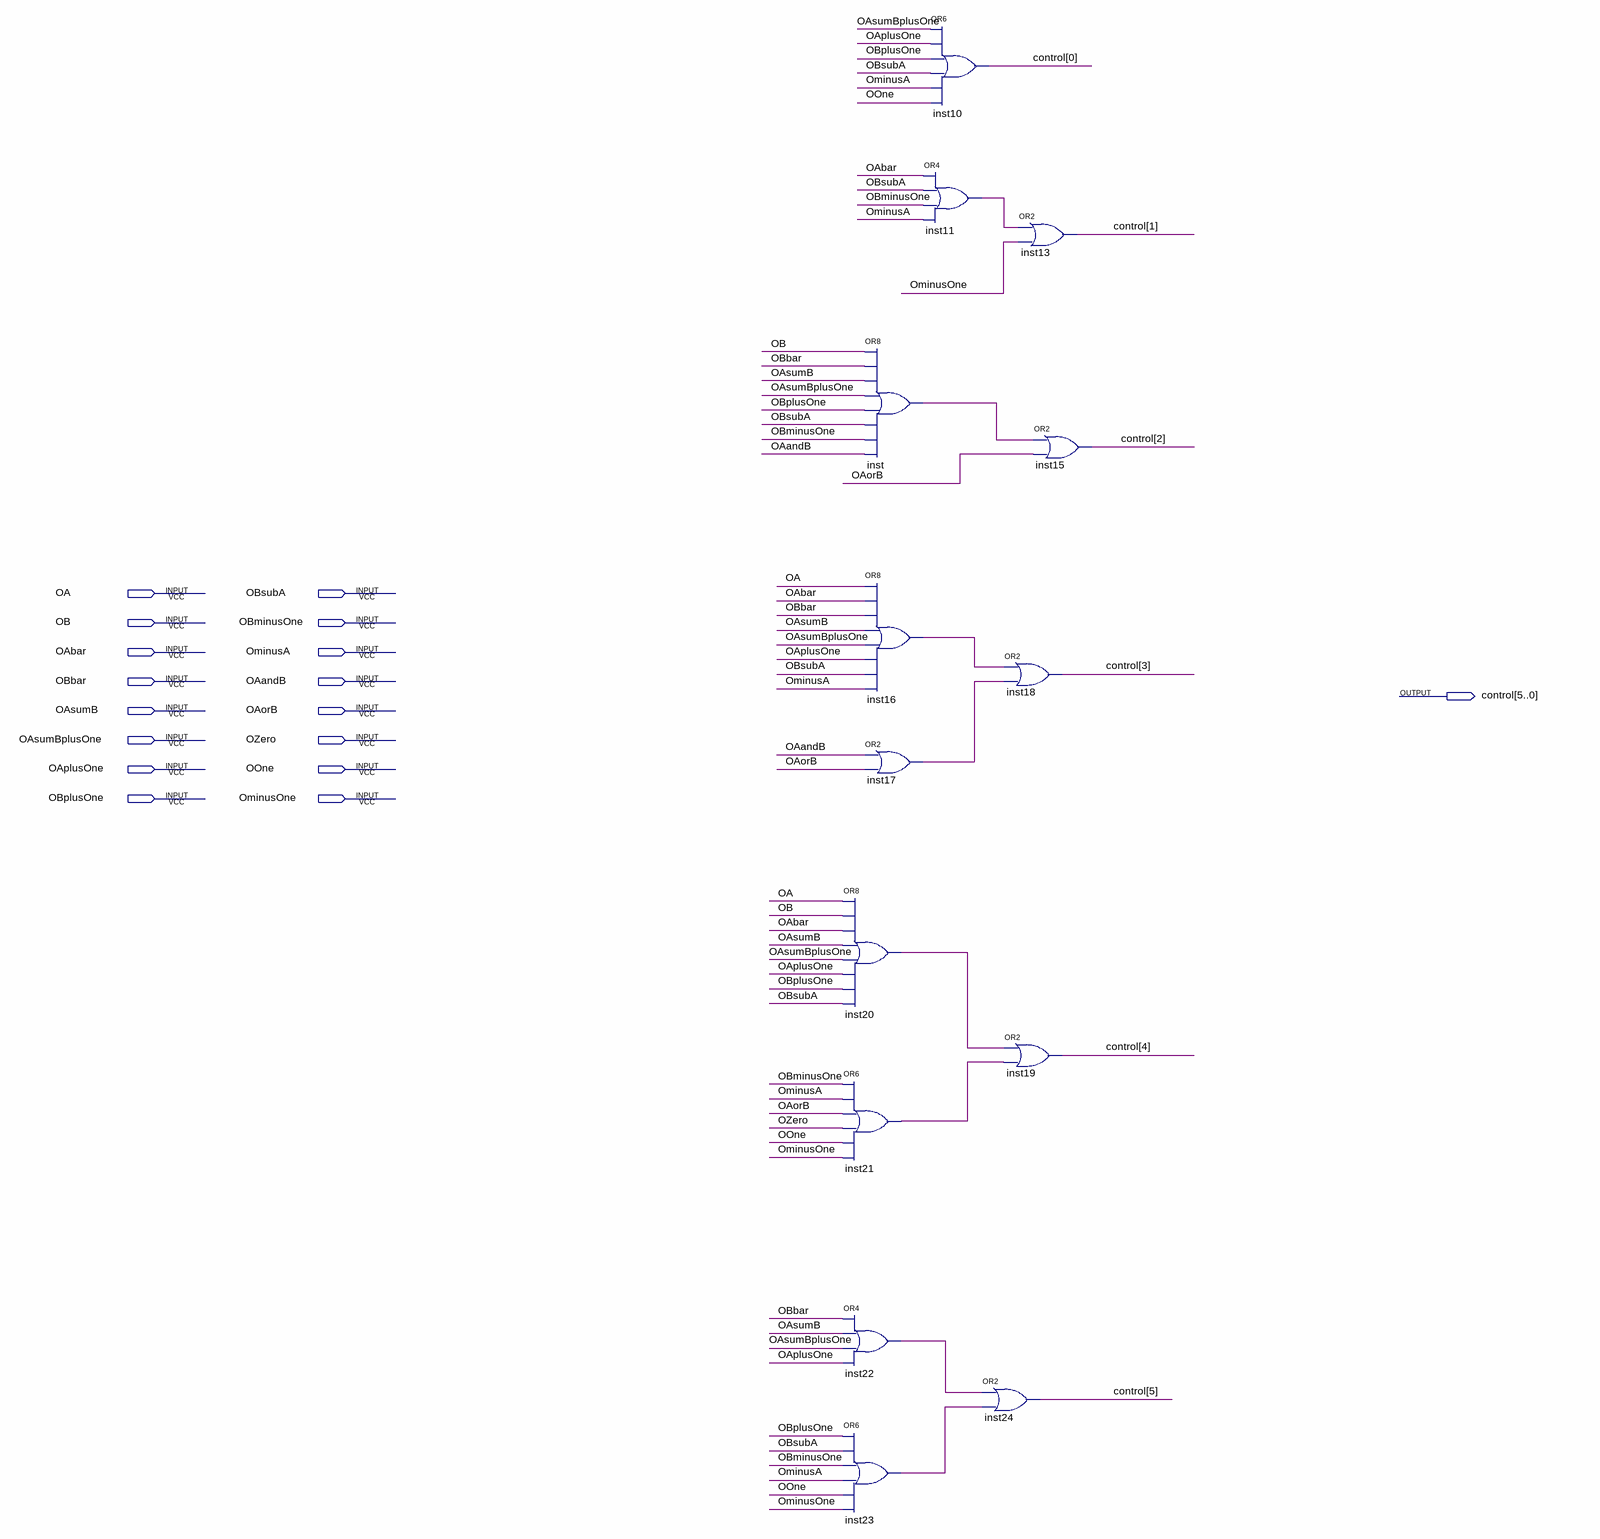
[diagram p0: schematic sheet]
// Quartus schematic ALUMapper.bdf as structural Verilog: 14 symbols, 17 pins
module ALUMapper (
  input  OA,
  input  OBsubA,
  input  OB,
  input  OBminusOne,
  input  OAbar,
  input  OminusA,
  input  OBbar,
  input  OAandB,
  input  OAsumB,
  input  OAorB,
  input  OAsumBplusOne,
  input  OZero,
  input  OAplusOne,
  input  OOne,
  input  OBplusOne,
  input  OminusOne,
  output [5:0] control
);

  wire inst11_out, inst16_out, inst17_out, inst20_out, inst21_out, inst22_out, inst23_out, inst_out;

  or inst (inst_out, OB, OBbar, OAsumB, OAsumBplusOne, OBplusOne, OBsubA, OBminusOne, OAandB);
  or inst16 (inst16_out, OA, OAbar, OBbar, OAsumB, OAsumBplusOne, OAplusOne, OBsubA, OminusA);
  or inst17 (inst17_out, OAandB, OAorB);
  or inst20 (inst20_out, OA, OB, OAbar, OAsumB, OAsumBplusOne, OAplusOne, OBplusOne, OBsubA);
  or inst21 (inst21_out, OBminusOne, OminusA, OAorB, OZero, OOne, OminusOne);
  or inst22 (inst22_out, OBbar, OAsumB, OAsumBplusOne, OAplusOne);
  or inst23 (inst23_out, OBplusOne, OBsubA, OBminusOne, OminusA, OOne, OminusOne);
  or inst10 (control[0], OAsumBplusOne, OAplusOne, OBplusOne, OBsubA, OminusA, OOne);
  or inst11 (inst11_out, OAbar, OBsubA, OBminusOne, OminusA);
  or inst24 (control[5], inst22_out, inst23_out);
  or inst13 (control[1], inst11_out, OminusOne);
  or inst15 (control[2], inst_out, OAorB);
  or inst18 (control[3], inst16_out, inst17_out);
  or inst19 (control[4], inst20_out, inst21_out);
endmodule
